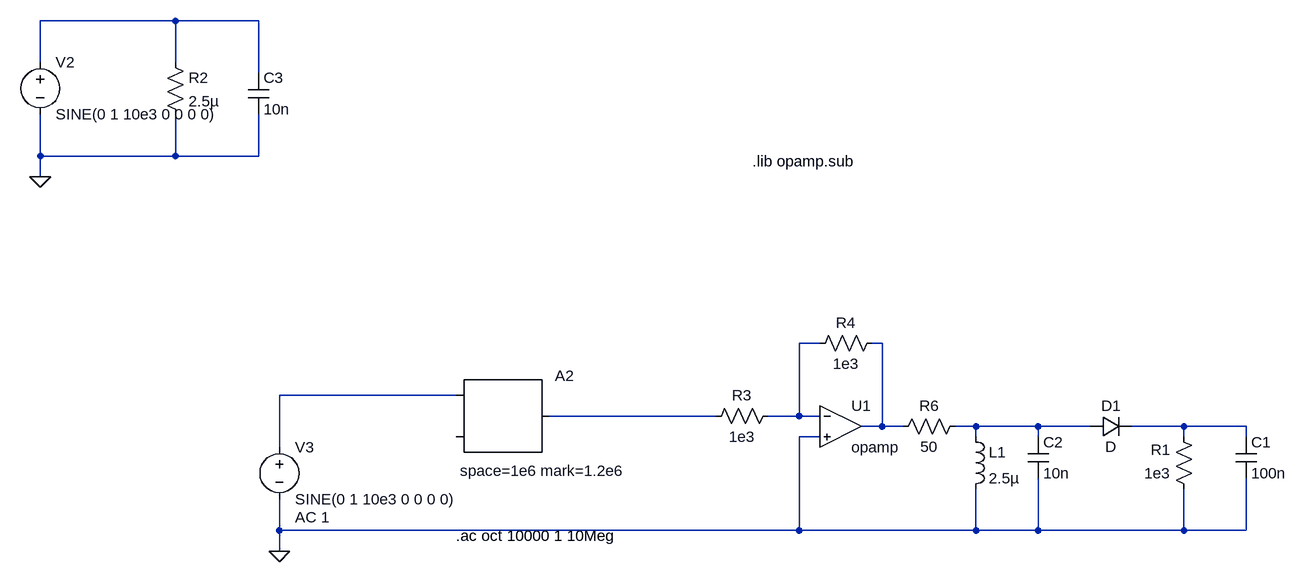
[diagram p0: schematic Draft1.asc]
Draft1.asc, the LTspice schematic file:
Version 4.1
SHEET 1 1240 680
WIRE -480 -448 -688 -448
WIRE -352 -448 -480 -448
WIRE -688 -384 -688 -448
WIRE -480 -384 -480 -448
WIRE -352 -368 -352 -448
WIRE -688 -240 -688 -304
WIRE -480 -240 -480 -304
WIRE -480 -240 -688 -240
WIRE -352 -240 -352 -304
WIRE -352 -240 -480 -240
WIRE -688 -208 -688 -240
WIRE 512 48 480 48
WIRE 608 48 592 48
WIRE -48 128 -320 128
WIRE 352 160 96 160
WIRE 480 160 480 48
WIRE 480 160 432 160
WIRE 512 160 480 160
WIRE 608 176 608 48
WIRE 608 176 576 176
WIRE 640 176 608 176
WIRE 752 176 720 176
WIRE 848 176 752 176
WIRE 928 176 848 176
WIRE 1072 176 992 176
WIRE 1168 176 1072 176
WIRE 512 192 480 192
WIRE 752 192 752 176
WIRE 848 192 848 176
WIRE 1072 192 1072 176
WIRE 1168 192 1168 176
WIRE -320 208 -320 128
WIRE -320 336 -320 288
WIRE 480 336 480 192
WIRE 480 336 -320 336
WIRE 752 336 752 272
WIRE 752 336 480 336
WIRE 848 336 848 256
WIRE 848 336 752 336
WIRE 1072 336 1072 272
WIRE 1072 336 848 336
WIRE 1168 336 1168 256
WIRE 1168 336 1072 336
WIRE -320 368 -320 336
FLAG -320 368 0
FLAG -688 -208 0
SYMBOL res 1088 288 R180
WINDOW 0 36 76 Left 2
WINDOW 3 36 40 Left 2
SYMATTR InstName R1
SYMATTR Value 1e3
SYMBOL OpAmps\\opamp 544 112 R0
SYMATTR InstName U1
SYMBOL res -496 -400 R0
SYMATTR InstName R2
SYMATTR Value 2.5µ
SYMBOL res 448 144 R90
WINDOW 0 0 56 VBottom 2
WINDOW 3 32 56 VTop 2
SYMATTR InstName R3
SYMATTR Value 1e3
SYMBOL res 608 32 R90
WINDOW 0 0 56 VBottom 2
WINDOW 3 32 56 VTop 2
SYMATTR InstName R4
SYMATTR Value 1e3
SYMBOL res 736 160 R90
WINDOW 0 0 56 VBottom 2
WINDOW 3 32 56 VTop 2
SYMATTR InstName R6
SYMATTR Value 50
SYMBOL ind 736 176 R0
SYMATTR InstName L1
SYMATTR Value 2.5µ
SYMBOL cap 1152 192 R0
SYMATTR InstName C1
SYMATTR Value 100n
SYMBOL cap 832 192 R0
SYMATTR InstName C2
SYMATTR Value 10n
SYMBOL diode 928 192 R270
WINDOW 0 32 32 VTop 2
WINDOW 3 0 32 VBottom 2
SYMATTR InstName D1
SYMBOL cap -368 -368 R0
SYMATTR InstName C3
SYMATTR Value 10n
SYMBOL voltage -688 -400 R0
WINDOW 123 0 0 Left 0
WINDOW 39 0 0 Left 0
SYMATTR InstName V2
SYMATTR Value SINE(0 1 10e3 0 0 0 0)
SYMBOL voltage -320 192 R0
WINDOW 123 24 124 Left 2
WINDOW 39 0 0 Left 2
SYMATTR Value2 AC 1
SYMATTR InstName V3
SYMATTR Value SINE(0 1 10e3 0 0 0 0)
SYMBOL SpecialFunctions\\modulate -48 128 R0
WINDOW 3 6 116 Left 2
SYMATTR Value space=1e6 mark=1.2e6
SYMATTR InstName A2
TEXT 408 -232 Left 2 !.lib opamp.sub
TEXT -48 344 Left 2 !.ac oct 10000 1 10Meg

The netlist it stands for:
* Draft1.asc
R1 0 N007 1e3
X§U1 N002 0 N003 opamp Aol=100K GBW=10Meg  ; pins invin noninvin out
R2 N001 0 2.5µ
R3 N002 N005 1e3
R4 N003 N002 1e3
R6 N006 N003 50
L1 N006 0 2.5µ
C1 N007 0 100n
C2 N006 0 10n
D1 N006 N007 D
C3 N001 0 10n
V2 N001 0 SINE(0 1 10e3 0 0 0 0)
V3 N004 0 SINE(0 1 10e3 0 0 0 0) AC 1
A2 N004 0 0 0 0 0 N005 0 MODULATOR space=1e6 mark=1.2e6
.model D D
.lib standard.dio
.lib opamp.sub
.ac oct 10000 1 10Meg
.backanno
.end